# EAGLE design sputnik_prototype_RadioCom (EAGLE 7.4.0)
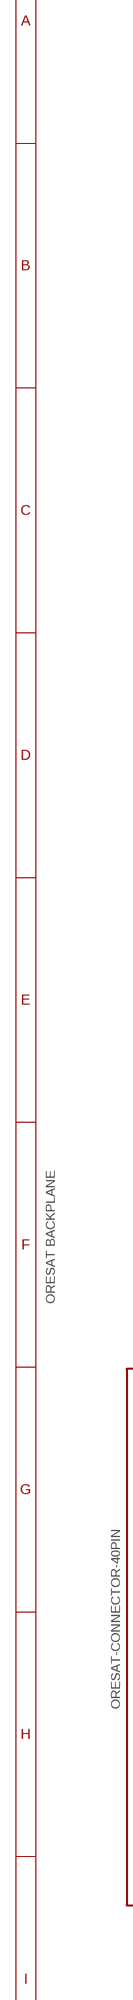
[diagram p0: schematic, sheet 1, part 1 of 2]
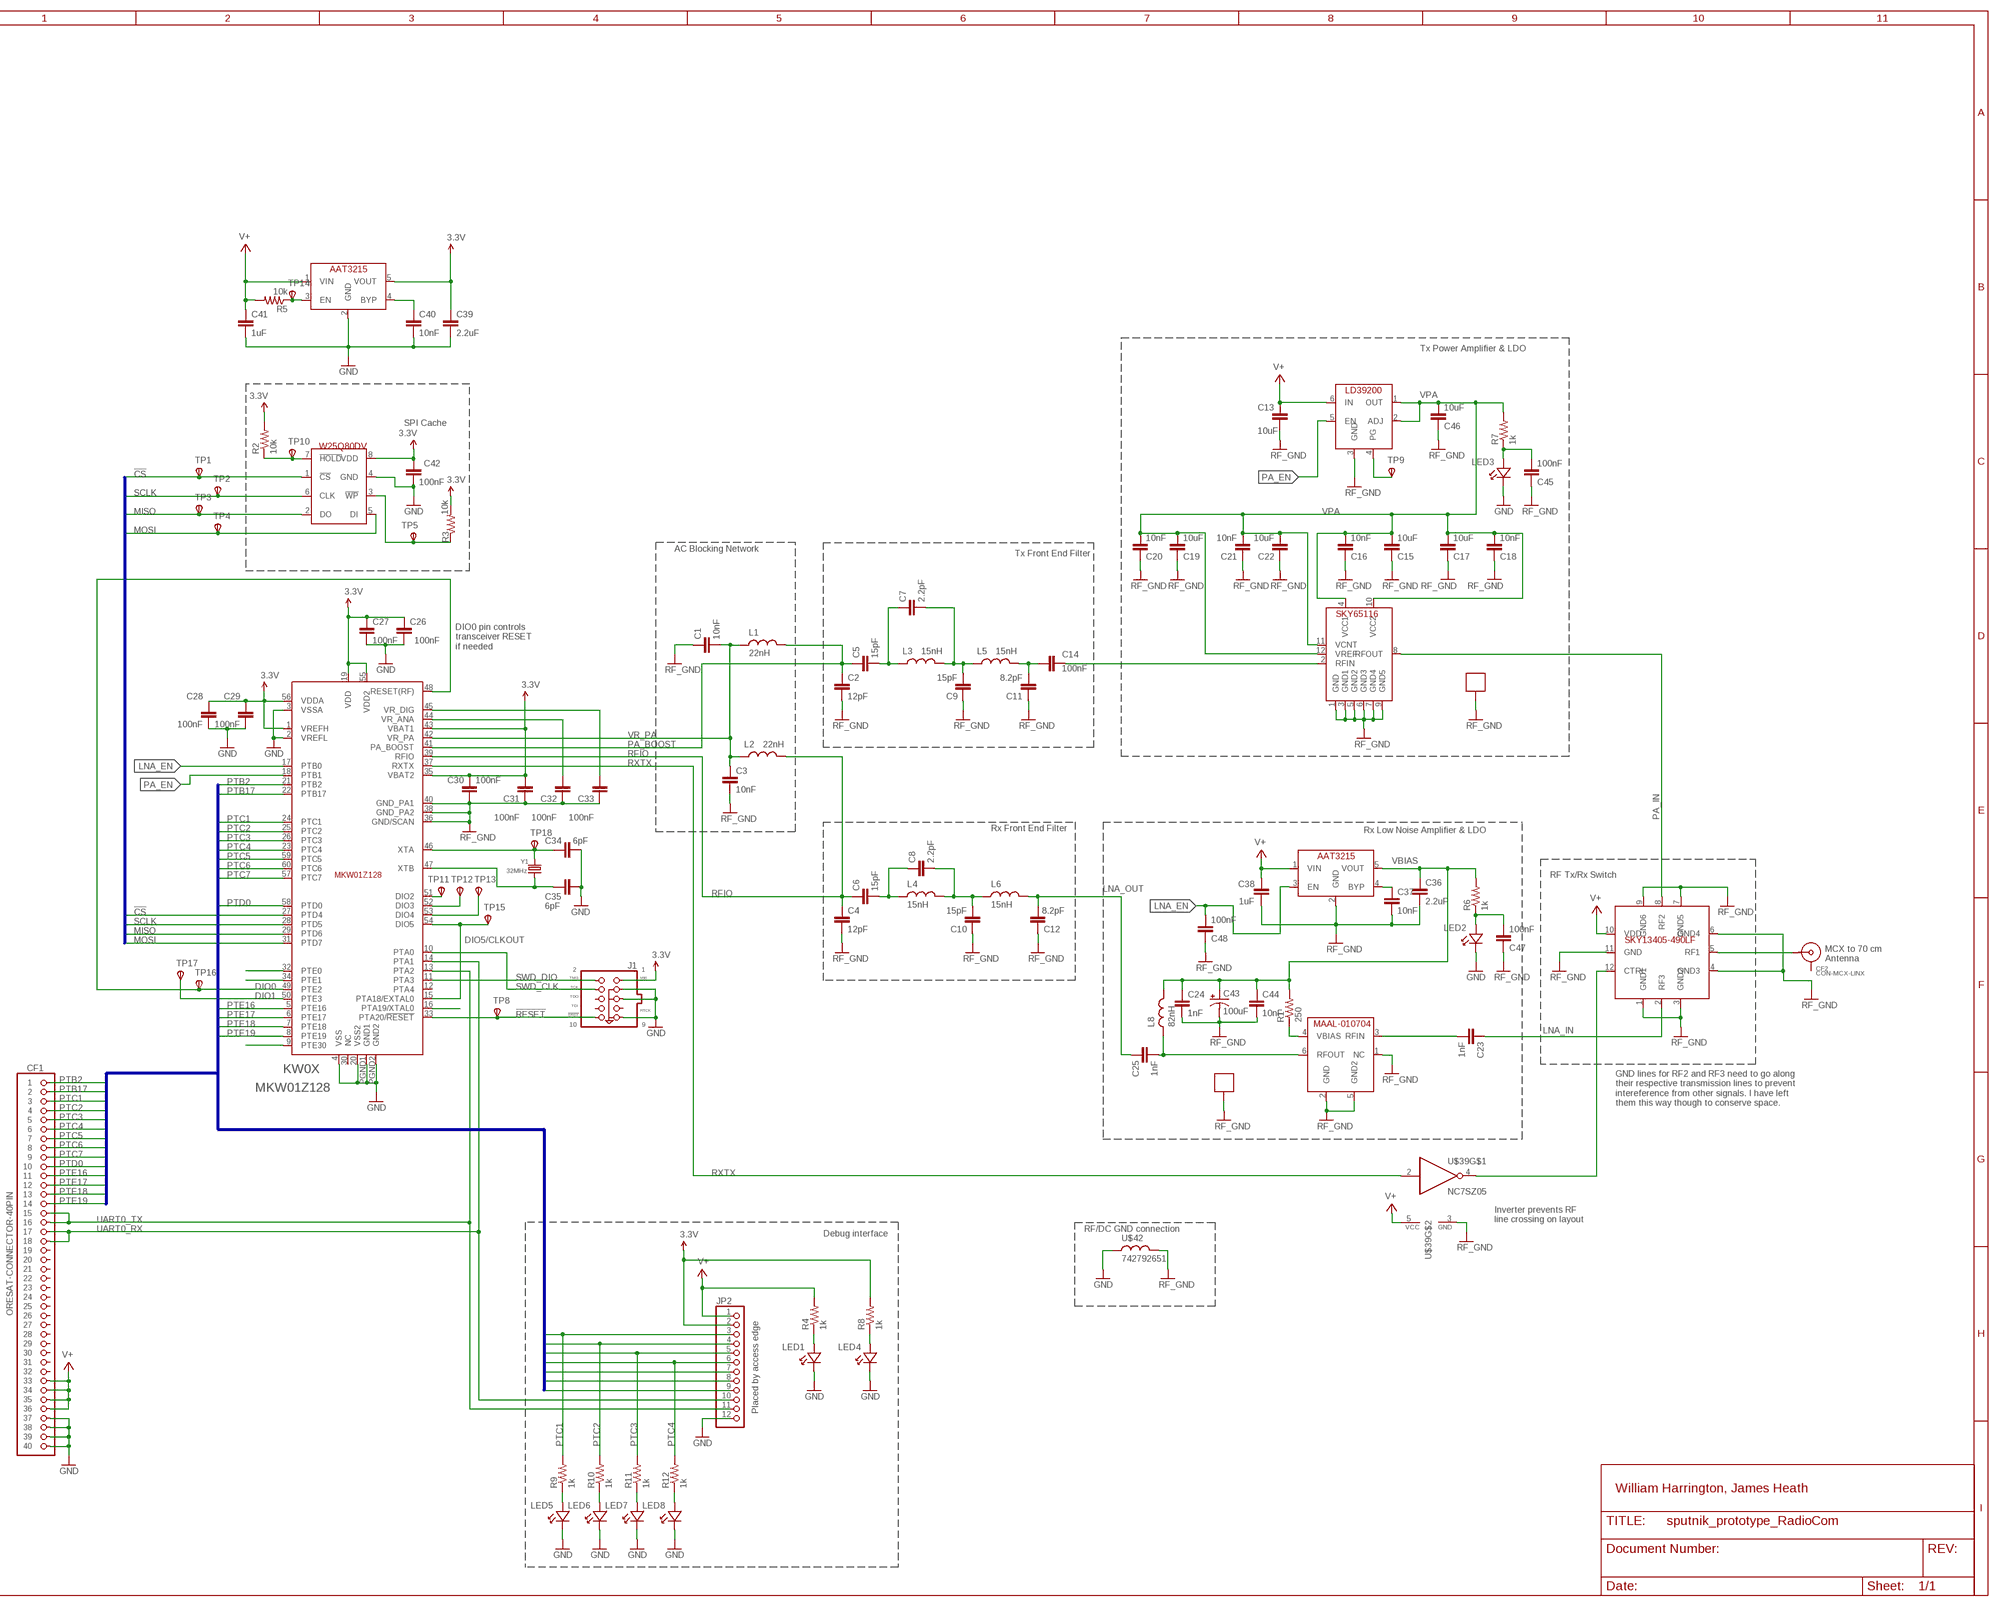
[diagram p1: schematic, sheet 1, part 2 of 2]

## Parts
C1  10nF  C-EU0603-B-NOSILK  [.0603-B-NOSILK]
C2  12pF  C-EU0603-B-NOSILK  [.0603-B-NOSILK]
C3  10nF  C-EU0603-B-NOSILK  [.0603-B-NOSILK]
C4  12pF  C-EU0603-B-NOSILK  [.0603-B-NOSILK]
C5  15pF  C-EU0603-B-NOSILK  [.0603-B-NOSILK]
C6  15pF  C-EU0603-B-NOSILK  [.0603-B-NOSILK]
C7  2.2pF  C-EU0603-B-NOSILK  [.0603-B-NOSILK]
C8  2.2pF  C-EU0603-B-NOSILK  [.0603-B-NOSILK]
C9  15pF  C-EU0603-B-NOSILK  [.0603-B-NOSILK]
C10  15pF  C-EU0603-B-NOSILK  [.0603-B-NOSILK]
C11  8.2pF  C-EU0603-B-NOSILK  [.0603-B-NOSILK]
C12  8.2pF  C-EU0603-B-NOSILK  [.0603-B-NOSILK]
C13  10uF  C-EU0603-B-NOSILK  [.0603-B-NOSILK]
C14  100nF  C-EU0603-B-NOSILK  [.0603-B-NOSILK]
C15  10uF  C-EU0603-B-NOSILK  [.0603-B-NOSILK]
C16  10nF  C-EU0603-B-NOSILK  [.0603-B-NOSILK]
C17  10uF  C-EU0603-B-NOSILK  [.0603-B-NOSILK]
C18  10nF  C-EU0603-B-NOSILK  [.0603-B-NOSILK]
C19  10uF  C-EU0603-B-NOSILK  [.0603-B-NOSILK]
C20  10nF  C-EU0603-B-NOSILK  [.0603-B-NOSILK]
C21  10nF  C-EU0603-B-NOSILK  [.0603-B-NOSILK]
C22  10uF  C-EU0603-B-NOSILK  [.0603-B-NOSILK]
C23  1nF  C-EU0402-B-NOSILK  [.0402-B-NOSILK]
C24  1nF  C-EU0402-B-NOSILK  [.0402-B-NOSILK]
C25  1nF  C-EU0402-B-NOSILK  [.0402-B-NOSILK]
C26  100nF  C-EU0603-B-NOSILK  [.0603-B-NOSILK]
C27  100nF  C-EU0603-B-NOSILK  [.0603-B-NOSILK]
C28  100nF  C-EU0603-B-NOSILK  [.0603-B-NOSILK]
C29  100nF  C-EU0603-B-NOSILK  [.0603-B-NOSILK]
C30  100nF  C-EU0603-B-NOSILK  [.0603-B-NOSILK]
C31  100nF  C-EU0603-B-NOSILK  [.0603-B-NOSILK]
C32  100nF  C-EU0603-B-NOSILK  [.0603-B-NOSILK]
C33  100nF  C-EU0603-B-NOSILK  [.0603-B-NOSILK]
C34  6pF  C-EU0603-B-NOSILK  [.0603-B-NOSILK]
C35  6pF  C-EU0603-B-NOSILK  [.0603-B-NOSILK]
C36  2.2uF  C-EU0402-B-NOSILK  [.0402-B-NOSILK]
C37  10nF  C-EU0402-B-NOSILK  [.0402-B-NOSILK]
C38  1uF  C-EU0402-B-NOSILK  [.0402-B-NOSILK]
C39  2.2uF  C-EU0402-B-NOSILK  [.0402-B-NOSILK]
C40  10nF  C-EU0402-B-NOSILK  [.0402-B-NOSILK]
C41  1uF  C-EU0402-B-NOSILK  [.0402-B-NOSILK]
C42  100nF  C-EU0603-B-NOSILK  [.0603-B-NOSILK]
C43  100uF  CPOL-USCT6032  [CT6032]
C44  10nF  C-EU0402-B-NOSILK  [.0402-B-NOSILK]
C45  100nF  C-EU0603-B-NOSILK  [.0603-B-NOSILK]
C46  10uF  C-EU0603-B-NOSILK  [.0603-B-NOSILK]
C47  100nF  C-EU0603-B-NOSILK  [.0603-B-NOSILK]
C48  100nF  C-EU0603-B-NOSILK  [.0603-B-NOSILK]
CF1  ORESAT-CONNECTOR-40PIN  [HARWIN-ARCHER-M50-3202045]
CF2  CON-MCX-LINX  [CON-MCX-LINX-CONMCX003.062]
J1  JTAG_ARM-10-50MIL  [PINHEADER-2X5-0.05+POL+SILK]
JP2  PINHD-1X12  [1X12]
KW0X  MKW01Z128  [MKW01Z128]
L1  22nH  L-US0603-B-NOSILK  [.0603-B-NOSILK]
L2  22nH  L-US0603-B-NOSILK  [.0603-B-NOSILK]
L3  15nH  L-US0603-B-NOSILK  [.0603-B-NOSILK]
L4  15nH  L-US0603-B-NOSILK  [.0603-B-NOSILK]
L5  15nH  L-US0603-B-NOSILK  [.0603-B-NOSILK]
L6  15nH  L-US0603-B-NOSILK  [.0603-B-NOSILK]
L8  82nH  L-US0603-B-NOSILK  [.0603-B-NOSILK]
LED1  LED-0603  [LED-0603]
LED2  LED-0603  [LED-0603]
LED3  LED-0603  [LED-0603]
LED4  LED-0603  [LED-0603]
LED5  LED-0603  [LED-0603]
LED6  LED-0603  [LED-0603]
LED7  LED-0603  [LED-0603]
LED8  LED-0603  [LED-0603]
LNA  MAAL-010704  [MAAL-010704]
PA  SKY65116  [SKY65116]
R1  250  R-US_0603-B-NOSILK  [.0603-B-NOSILK]
R2  10k  R-US_0603-B-NOSILK  [.0603-B-NOSILK]
R3  10k  R-US_0603-B-NOSILK  [.0603-B-NOSILK]
R4  1k  R-US_0603-B-NOSILK  [.0603-B-NOSILK]
R5  10k  R-US_0603-B-NOSILK  [.0603-B-NOSILK]
R6  1k  R-US_0603-B-NOSILK  [.0603-B-NOSILK]
R7  1k  R-US_0603-B-NOSILK  [.0603-B-NOSILK]
R8  1k  R-US_0603-B-NOSILK  [.0603-B-NOSILK]
R9  1k  R-US_0603-B-NOSILK  [.0603-B-NOSILK]
R10  1k  R-US_0603-B-NOSILK  [.0603-B-NOSILK]
R11  1k  R-US_0603-B-NOSILK  [.0603-B-NOSILK]
R12  1k  R-US_0603-B-NOSILK  [.0603-B-NOSILK]
SH1  BMI-S-202-SHIELD  [BMI-S-202]
SH2  BMI-S-202-SHIELD  [BMI-S-202]
TP1  TPSPAD1-13  [P1-13]
TP2  TPSPAD1-13  [P1-13]
TP3  TPSPAD1-13  [P1-13]
TP4  TPSPAD1-13  [P1-13]
TP5  TPSPAD1-13  [P1-13]
TP8  TPSPAD1-13  [P1-13]
TP9  TPSPAD1-13  [P1-13]
TP10  TPSPAD1-13  [P1-13]
TP11  TPSPAD1-13  [P1-13]
TP12  TPSPAD1-13  [P1-13]
TP13  TPSPAD1-13  [P1-13]
TP14  TPSPAD1-13  [P1-13]
TP15  TPSPAD1-13  [P1-13]
TP16  TPSPAD1-13  [P1-13]
TP17  TPSPAD1-13  [P1-13]
TP18  TPSPAD1-13  [P1-13]
TRSWITCH  SKY13405-490LF  [SKY13405-490LF]
U$1  W25Q80DV  [W25Q80DV]
U$7  AAT3215  [AAT3215]
U$8  AAT3215  [AAT3215]
U$9  LD39200  [LD39200]
U$39  NC7SZ05  [NC7SZ05]
U$42  742792651  [.0603-B-NOSILK]
Y1  32MHz  CRYSTAL2.5X2.0MM  [CRYSTAL_2.5X2]

## Nets
3.3V: C26.1 C27.1 C28.2 C29.2 C30.2 C31.2 C39.1 C42.2 J1.1(VDD) JP2.2 KW0X.1(VREFH) KW0X.19(VDD) KW0X.35(VBAT2) KW0X.43(VBAT1) KW0X.55(VDD2) KW0X.56(VDDA) R2.2 R3.2 R8.2 U$1.8(VDD) U$8.5(VOUT)
!CS: KW0X.27(PTD4) TP1.TP(PP) U$1.1(!CS)
!HOLD: R2.1 TP10.TP(PP) U$1.7(!HOLD)
!RESET: J1.10(SRST) KW0X.33(PTA20/!RESET) TP8.TP(PP)
ASD: C47.1 ; supply symbol labelled RF_GND
DIO0: KW0X.48(RESET(RF)) KW0X.49(PTE2) TP16.TP(PP)
DIO1: KW0X.50(PTE3) TP17.TP(PP)
DIO5/CLKOUT: KW0X.15(PTA18/EXTAL0) KW0X.54(DIO5) TP15.TP(PP)
GND: C26.2 C27.2 C28.1 C29.1 C34.1 C35.1 C36.2 C37.2 C38.2 C39.2 C40.2 C41.2 C42.1 C48.1 CF1.P$37 CF1.P$38 CF1.P$39 CF1.P$40 J1.3(GND3) J1.5(GND5) J1.9(GND9) JP2.12 KW0X.2(VREFL) KW0X.3(VSSA) KW0X.4(VSS) KW0X.20(VSS2) KW0X.PGND1(GND1) KW0X.PGND2(GND2) LED1.K LED2.K LED3.K LED4.K LED5.K LED6.K LED7.K LED8.K LNA.1(NC) TRSWITCH.11(GND) U$1.4(GND) U$7.2(GND) U$8.2(GND) U$42.1 ; supply symbol labelled RF_GND
LNA_EN: C48.2 KW0X.17(PTB0) U$7.3(EN)
LNA_IN: C23.1 TRSWITCH.2(RF3)
LNA_OUT: C12.2 C25.1 L6.2
MISO: KW0X.29(PTD6) TP3.TP(PP) U$1.2(DO)
MOSI: KW0X.31(PTD7) TP4.TP(PP) U$1.5(DI)
N$1: C37.1 U$7.4(BYP)
N$2: TRSWITCH.12(CTRL) U$39.4(OUT)
N$3: KW0X.51(DIO2) TP11.TP(PP)
N$4: TP9.TP(PP) U$9.4(PG)
N$5: KW0X.52(DIO3) TP12.TP(PP)
N$6: C34.2 KW0X.46(XTA) TP18.TP(PP) Y1.1
N$7: C25.2 L8.1 LNA.6(RFOUT)
N$8: C35.2 KW0X.47(XTB) Y1.3
N$9: KW0X.53(DIO4) TP13.TP(PP)
N$10: C5.2 C7.1 L3.1
N$11: R3.1 TP5.TP(PP) U$1.3(!WP)
N$12: R5.1 TP14.TP(PP) U$8.3(EN)
N$13: C40.1 U$8.4(BYP)
N$14: LED1.A R4.1
N$15: LED5.A R9.1
N$16: C7.2 C9.2 L3.2 L5.1
N$17: C11.2 C14.2 L5.2
N$18: C6.2 C8.1 L4.1
N$19: C8.2 C10.2 L4.2 L6.1
N$20: LED6.A R10.1
N$21: LED7.A R11.1
N$22: LED4.A R8.1
N$23: LED8.A R12.1
N$25: C23.2 LNA.3(RFIN)
N$27: LNA.4(VBIAS) R1.1
N$30: CF2.CENTER TRSWITCH.5(RF1)
N$31: C32.2 KW0X.44(VR_ANA)
N$34: C33.2 KW0X.45(VR_DIG)
N$43: C14.1 PA.2(RFIN)
PA_BOOST: C2.1 C5.1 KW0X.41(PA_BOOST) L1.2
PA_EN: KW0X.18(PTB1) U$9.5(EN)
PA_IN: PA.8(RFOUT) TRSWITCH.8(RF2)
PTA19: KW0X.16(PTA19/XTAL0)
PTB2: CF1.P$1 KW0X.21(PTB2)
PTB17: CF1.P$2 KW0X.22(PTB17)
PTC1: CF1.P$3 JP2.3 KW0X.24(PTC1) R9.2
PTC2: CF1.P$4 JP2.4 KW0X.25(PTC2) R10.2
PTC3: CF1.P$5 JP2.5 KW0X.26(PTC3) R11.2
PTC4: CF1.P$6 JP2.6 KW0X.23(PTC4) R12.2
PTC5: CF1.P$7 JP2.7 KW0X.59(PTC5)
PTC6: CF1.P$8 JP2.8 KW0X.60(PTC6)
PTC7: CF1.P$9 JP2.9 KW0X.57(PTC7)
PTD0: CF1.P$10 KW0X.58(PTD0)
PTE0: KW0X.32(PTE0)
PTE1: KW0X.34(PTE1)
PTE16: CF1.P$11 KW0X.5(PTE16)
PTE17: CF1.P$12 KW0X.6(PTE17)
PTE18: CF1.P$13 KW0X.7(PTE18)
PTE19: CF1.P$14 KW0X.8(PTE19)
PTE30: KW0X.9(PTE30)
RF_GND: C1.1 C2.2 C3.2 C4.2 C9.1 C10.1 C11.1 C12.1 C13.1 C15.1 C16.1 C17.1 C18.1 C19.1 C20.1 C21.1 C22.1 C24.2 C30.1 C31.1 C32.1 C33.1 C43.- C44.2 C45.1 C46.1 KW0X.36(GND/SCAN) KW0X.38(GND_PA2) KW0X.40(GND_PA1) LNA.2(GND) LNA.5(GND2) PA.1(GND) PA.3(GND1) PA.5(GND2) PA.6(GND3) PA.7(GND4) PA.9(GND5) SH1.P$1 SH1.P$2 SH1.P$3 SH1.P$4 SH1.P$5 SH1.P$6 SH1.P$7 SH1.P$8 SH1.P$9 SH1.P$10 SH1.P$11 SH1.P$12 SH2.P$1 SH2.P$2 SH2.P$3 SH2.P$4 SH2.P$5 SH2.P$6 SH2.P$7 SH2.P$8 SH2.P$9 SH2.P$10 SH2.P$11 SH2.P$12 TRSWITCH.1(GND1) TRSWITCH.3(GND2) TRSWITCH.4(GND3) TRSWITCH.6(GND4) TRSWITCH.7(GND5) TRSWITCH.9(GND6) U$9.3(GND) U$39.3(GND) U$42.2
RFIO: C4.1 C6.1 KW0X.39(RFIO) L2.2
RXTX: KW0X.37(RXTX) U$39.2(IN)
SCLK: KW0X.28(PTD5) TP2.TP(PP) U$1.6(CLK)
SWD_CLK: J1.4(TCK) KW0X.10(PTA0)
SWD_DIO: J1.2(TMS) KW0X.11(PTA3)
UART0_RX: CF1.P$17 CF1.P$18 JP2.10 KW0X.14(PTA1)
UART0_TX: CF1.P$15 CF1.P$16 JP2.11 KW0X.13(PTA2)
V+: C13.2 C38.1 C41.1 CF1.P$33 CF1.P$34 CF1.P$35 CF1.P$36 JP2.1 R4.2 R5.2 TRSWITCH.10(VDD) U$7.1(VIN) U$8.1(VIN) U$9.6(IN) U$39.5(VCC)
V_LNA_FILTERED: C47.2 LED2.A R6.1
V_PA_FILTERED: C45.2 LED3.A R7.1
VBIAS: C24.1 C36.1 C43.+ C44.1 L8.2 R1.2 R6.2 U$7.5(VOUT)
VPA: C15.2 C16.2 C17.2 C18.2 C19.2 C20.2 C21.2 C22.2 C46.2 PA.4(VCC1) PA.10(VCC2) PA.11(VCNT) PA.12(VREF) R7.2 U$9.1(OUT) U$9.2(ADJ)
VR_PA: C1.2 C3.1 KW0X.42(VR_PA) L1.1 L2.1
Unconnected: CF1.P$19 CF1.P$20 CF1.P$21 CF1.P$22 CF1.P$23 CF1.P$24 CF1.P$25 CF1.P$26 CF1.P$27 CF1.P$28 CF1.P$29 CF1.P$30 CF1.P$31 CF1.P$32 CF2.SHIELD1(SHIELD) CF2.SHIELD2(SHIELD) CF2.SHIELD3(SHIELD) CF2.SHIELD4(SHIELD) J1.6(TDO) J1.7(RTCK) J1.8(TDI) KW0X.12(PTA4) KW0X.30(NC)

## Buses
PTB2,PTB17,PTC[1..7],PTD0,PTE[16..19],PTE30
!HOLD,!CS,SCLK,MISO,MOSI,!WP

## Notes on the sheet
- Tx Power Amplifier & LDO
- SPI Cache
- AC Blocking Network
- Tx Front End Filter
- DIO0 pin controls 
  transceiver RESET
  if needed
- Rx Low Noise Amplifier & LDO
- Rx Front End Filter
- RF Tx/Rx Switch
- MCX to 70 cm
  Antenna
- ORESAT BACKPLANE
- GND lines for RF2 and RF3 need to go along
  their respective transmission lines to prevent
  intereference from other signals. I have left
  them this way though to conserve space.
- Inverter prevents RF 
  line crossing on layout
- RF/DC GND connection
- Debug interface
- Placed by access edge
- William Harrington, James Heath

## Library data of the parts
C1-C42 C44-C48 = rcl_custom:C-EU: CAPACITOR, European symbol
C43 = rcl:CPOL-US: POLARIZED CAPACITOR, American symbol
CF1 = oresat-eagle:ORESAT-CONNECTOR-40PIN: OreSat 40pin card connector. Uses the Harwin Archer M50-3202045.
CF2 = oresat-eagle:CON-MCX-LINX: Linx Technologies MCX Connector #CONMCX003.062
J1 = psas_c3_team05:JTAG_ARM-10-*: JTAG PIN HEADER 2x5 This is one of the (smaller) ARM standard JTAG connectors.
JP2 = pinhead:PINHD-1X12: PIN HEADER
KW0X = psas_c3_team05:MKW01Z128; DIST: Digi-Key; DPN: MKW01Z128CHN-ND; MFN: NXP; MPN: MKW01Z128CHN
L1-L6 L8 = rcl_custom:L-US: INDUCTOR, American symbol
LED1-LED8 = psas_c3_team05:LED: Generic LED with Color designator as an attribute.
LNA = sputnik:MAAL-010704: MACOM MAAL-010704 Low Noise Amplifier; DIST: Digi-Key; DPN: 1465-1261-6-ND; MFN: M/A-Com Technology Solutions; MPN: MAAL-010704-TR3000
PA = psas_c3_team05:SKY65116: SKYWORK SKY65116 LINEAR POWER AMPLIFIER; MFN: Skyworks; MPN: SKY65116
R1-R12 = rcl_custom:R-US_: RESISTOR, American symbol
SH1 SH2 = hw-laird-bmi-s-202:BMI-S-202-SHIELD
TP1-TP5 TP8-TP18 = testpad:TPS: TEST PIN
TRSWITCH = psas_c3_team05:SKY13405-490LF; MFN: Skyworks; MPN: SKY13405-490LF
U$1 = psas_c3_team05:W25Q80DV
U$7 U$8 = psas_c3_team05:AAT3215; MFN: Skyworks; MFN-PN: AAT3215
U$9 = psas_c3_team05:LD39200
U$39 = psas_c3_team05:NC7SZ05: Single Inverter
U$42 = psas_c3_team05:742792651: Ferrite Bead
Y1 = microbuilder:CRYSTAL: Crystals HC49UP - Surface Mount Crystal 4.0MHz 18pF +/-30ppm Surface Mount Crystal [Digikey: 535-9857-1-ND] 12.0 MHz Surface Mount Crystal [Digikey: 535-9869-6-ND] 25.0 MHz Surface Mount Crystal [Digikey: 535-9078-1-ND] 2.5 x 2.0mm - MEMs SMT Crystal 16.0 MHz 10pF 20ppm 2.5 x 2.0mm Crystal [Digikey -40-85°C: 535-10923-1-ND] 3.2 x 2.5mm - MEMs SMT Crystal 12.0 MHz 8pF 15ppm 3.2 x 2.5mm Crystal [Digikey: -10-70°C: 644-1047-1-ND -40-125°C: 644-1128-1-ND] 16.0 MHz 8pF 15ppm 3.2 x 2.5mm Crystal [Digikey: -10-70°C: 644-1049-1-ND -40-125°C: 644-1129-2-ND] 16.0 MHz 10pF 10ppm 3.2 x 2.5mm Crystal [Digikey: 644-1100-1-ND] 27.12 MHz 18pF 30ppm 3.2 x 2.5mm Crystal [Digikey: 887-1424-1-ND] 27.12MHz 10pF 10ppm 3.2 x 2.5mm Crystal [Digikey: 887-1329-1-ND] 4.9 x 1.8mm - MEMs SMT Crystal 32.768 KHz 12.5pF 20ppm 4.9 x 1.8mm Crystal [Digikey: SE2415CT-ND] 8.0 x 3.8mm - Surface Mount Crystal 32.768kHz 12.5pF 20ppm -40°C-85°C [Digikey: 535-9166-2-ND] Cylinder 32.768KHz Cylinder Crystal (2x6mm body) [Ex. Digikey: 300-8341-2-ND]; DIST: Digi-Key; DPN: SER4044CT-ND; MFN: EPSON; MPN: FA20H 32.0000MF12Y-W3

## Board
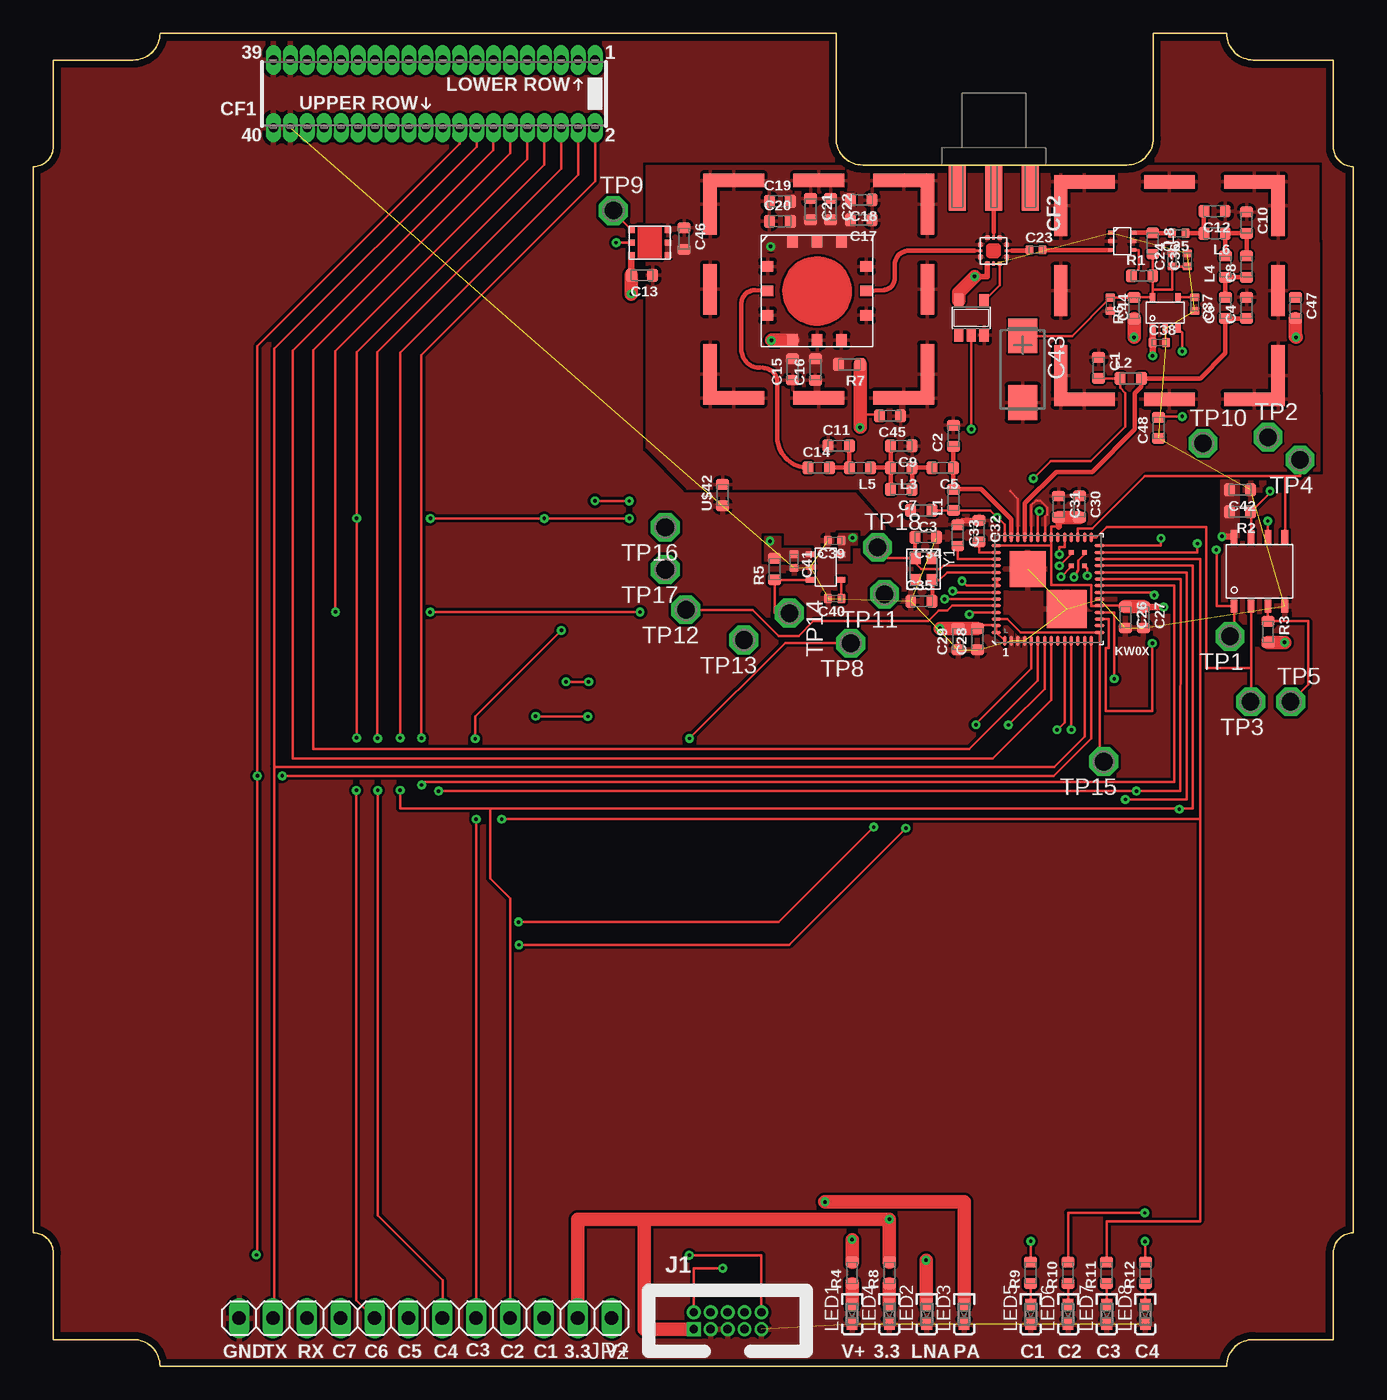
[diagram p2: board, top side]
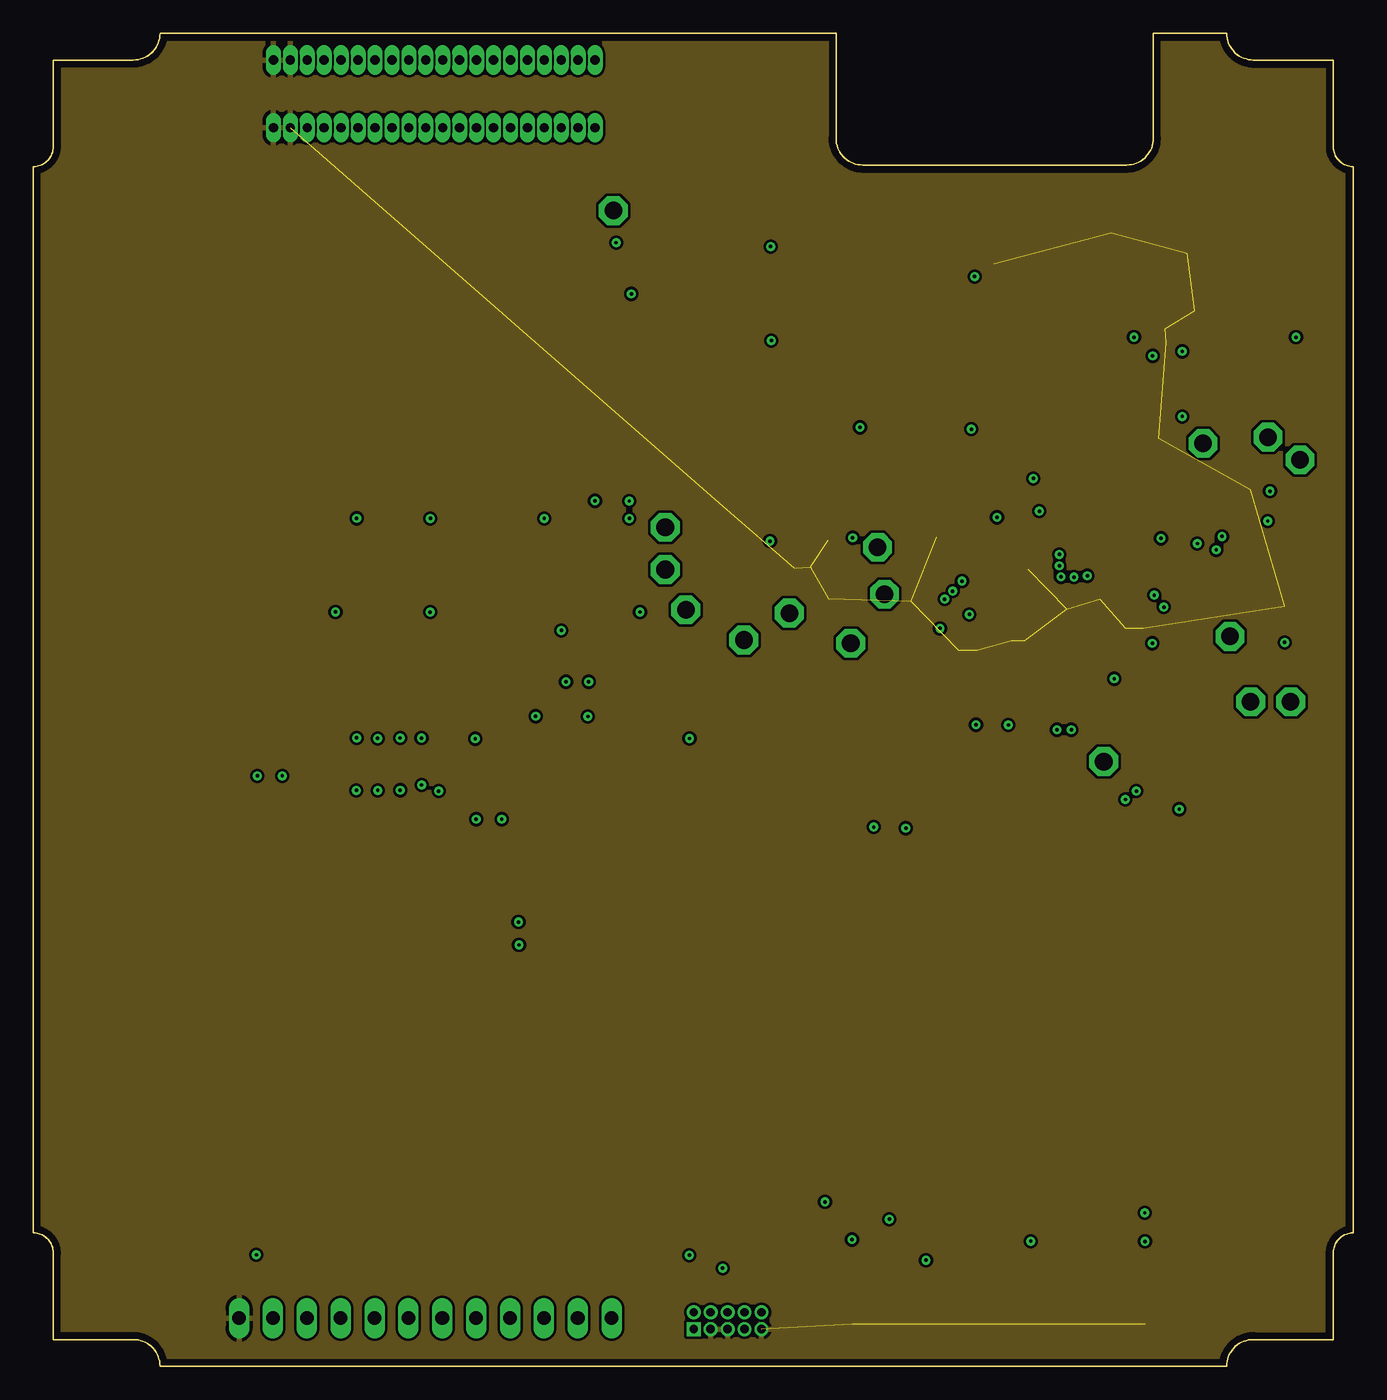
[diagram p3: board, inner layer Route2]
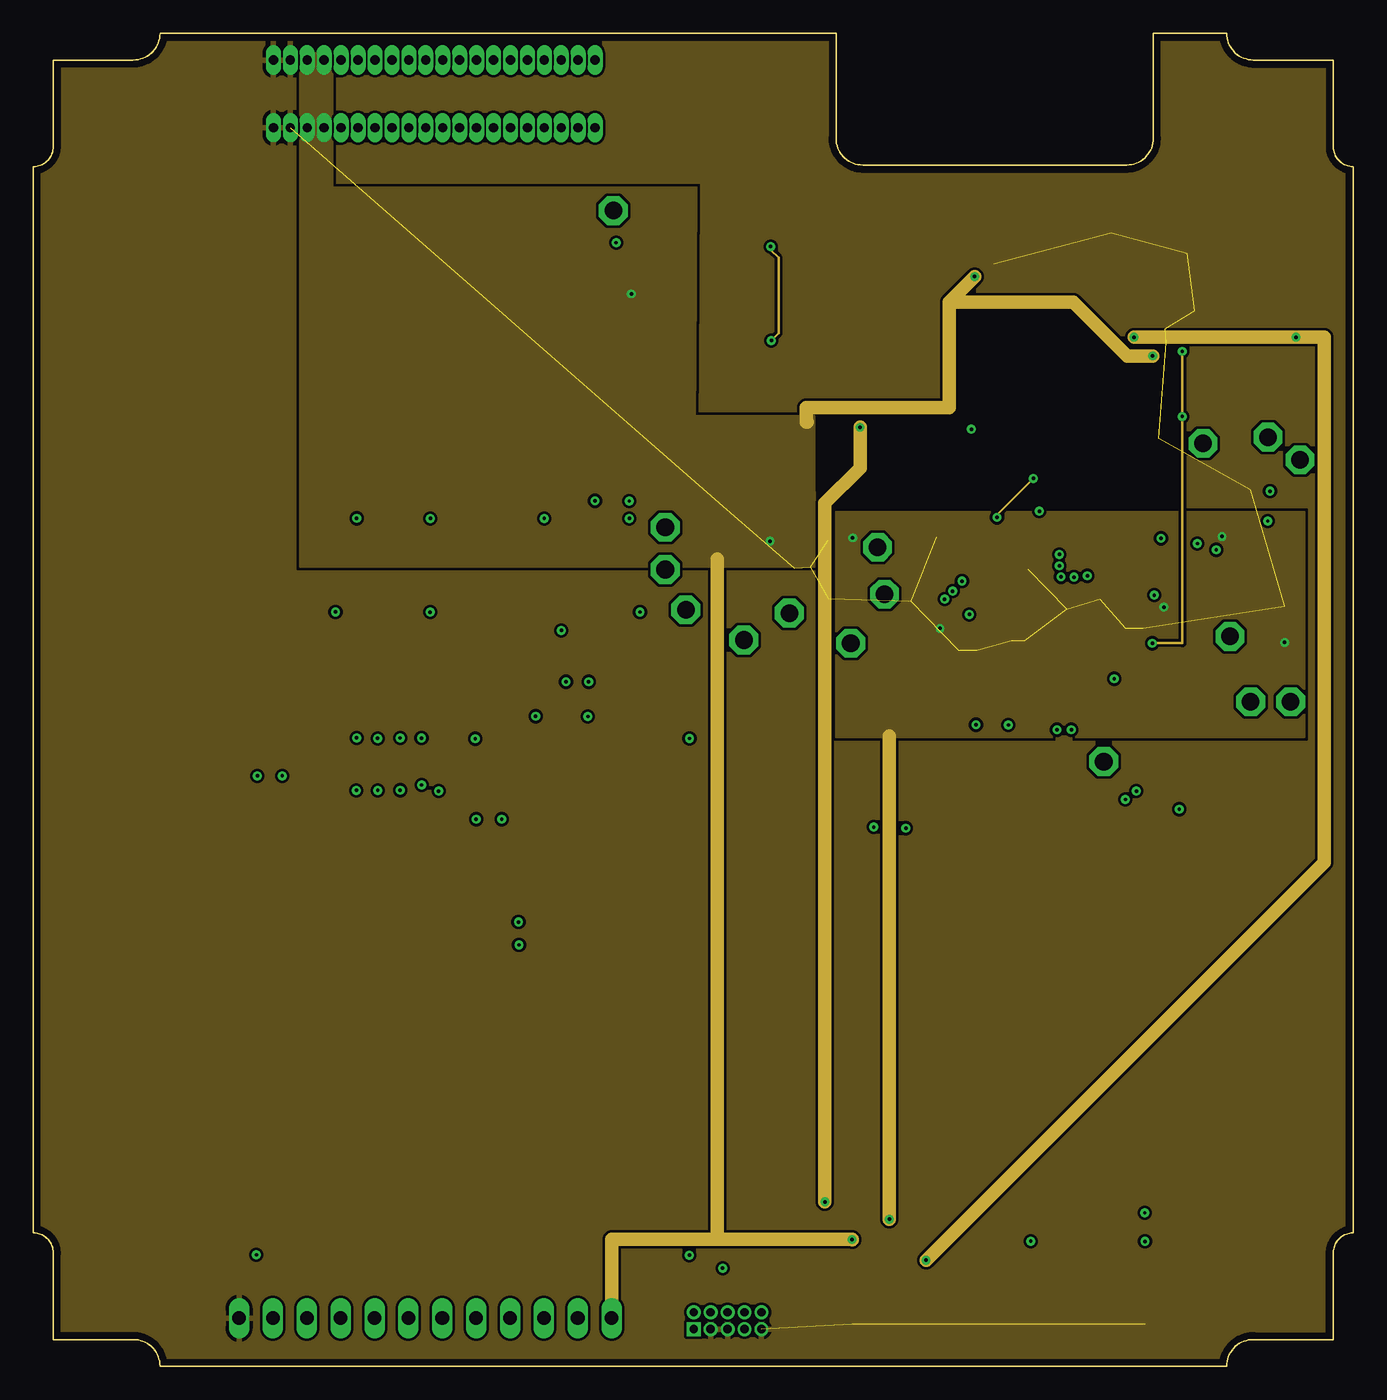
[diagram p4: board, inner layer Route15]
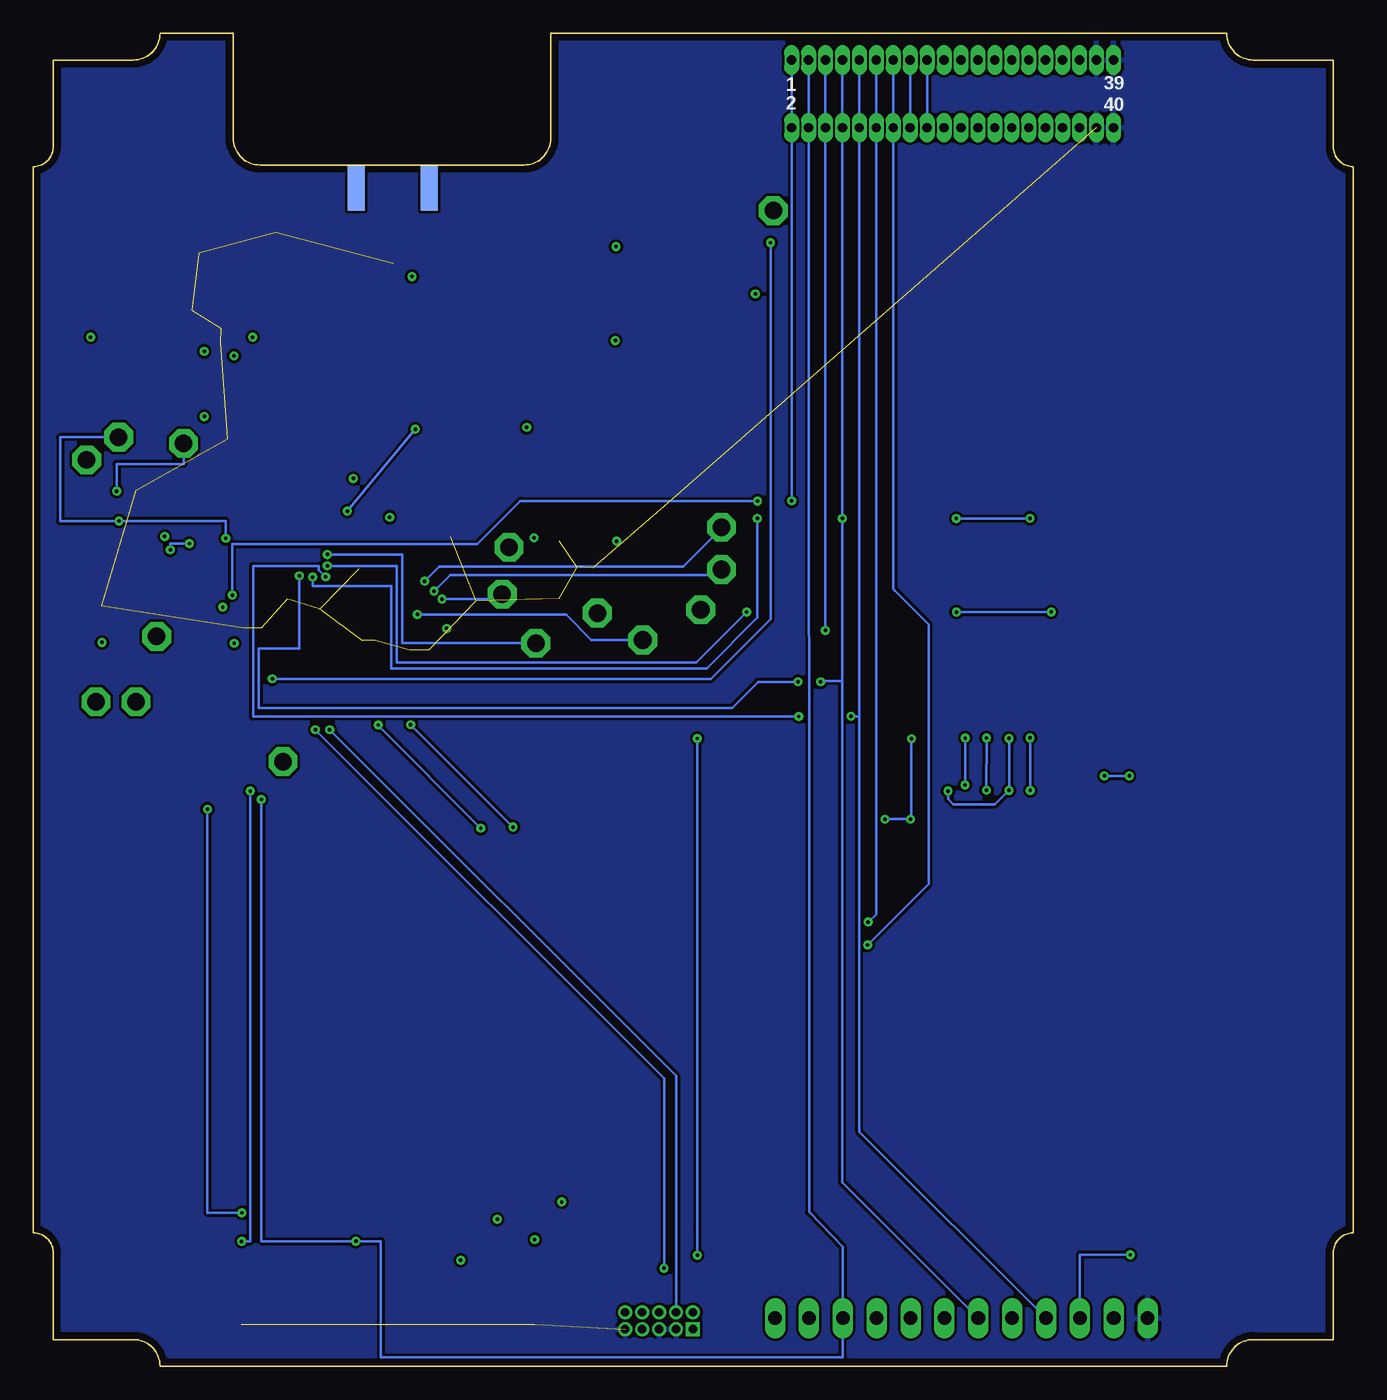
[diagram p5: board, bottom side, seen from below]

Size 99 x 100 mm. Coordinates in mm from the lower left corner, seen from the top.
Copper layers (1+2*15+16): Top 0.0178mm / dielectric 12mil / Route2 0.0356mm / dielectric 28mil / Route15 0.0356mm / dielectric 12mil / Bottom 0.0178mm
Design rules "sunstone-4Lyr_v1.0.0.3 *": minimum track width 6mil, minimum drill 10mil, track to track 6mil, track to pad 6mil, pad to pad 6mil, via to via 6mil, smd to smd 6mil, copper to edge 20mil, drill to drill 16mil, minimum pad ring 8mil, minimum via ring 8mil, stop-mask expansion 3mil, vias tented up to drill 11mil, thermal gap 10mil

### Footprints (pad centres in the part's own frame; a part is rotated, then mirrored left to right if it is on the bottom)
.0603-B-NOSILK = smd 0.8 x 0.95: 1 -0.8,0; 2 0.8,0
.0402-B-NOSILK = smd 0.6 x 0.7: 1 -0.5,0; 2 0.5,0
CT6032 = smd 2.6 x 2.2: + -2.5,0; - 2.5,0
HARWIN-ARCHER-M50-3202045 = drill 0.7 pad 1.07 long: P$1 -12.065,-2.54; P$2 -12.065,2.54; P$3 -10.795,-2.54; P$4 -10.795,2.54; P$5 -9.525,-2.54; P$6 -9.525,2.54; P$7 -8.255,-2.54; P$8 -8.255,2.54; P$9 -6.985,-2.54; P$10 -6.985,2.54; P$11 -5.715,-2.54; P$12 -5.715,2.54; P$13 -4.445,-2.54; P$14 -4.445,2.54; P$15 -3.175,-2.54; P$16 -3.175,2.54; P$17 -1.905,-2.54; P$18 -1.905,2.54; P$19 -0.635,-2.54; P$20 -0.635,2.54; P$21 0.635,-2.54; P$22 0.635,2.54; P$23 1.905,-2.54; P$24 1.905,2.54; P$25 3.175,-2.54; P$26 3.175,2.54; P$27 4.445,-2.54; P$28 4.445,2.54; P$29 5.715,-2.54; P$30 5.715,2.54; P$31 6.985,-2.54; P$32 6.985,2.54; P$33 8.255,-2.54; P$34 8.255,2.54; P$35 9.525,-2.54; P$36 9.525,2.54; P$37 10.795,-2.54; P$38 10.795,2.54; P$39 12.065,-2.54; P$40 12.065,2.54
CON-MCX-LINX-CONMCX003.062 = smd 3.43 x 1.27: CENTER -1.715,0; SHIELD1 -1.715,2.74; SHIELD2 -1.715,-2.74 | smd 3.43 x 1.27 bottom: SHIELD3 -1.715,2.74; SHIELD4 -1.715,-2.74
PINHEADER-2X5-0.05+POL+SILK = drill 0.635 pad 1.04 square: 1 -2.54,-0.635 | drill 0.635 pad 1.04: 2 -2.54,0.635; 3 -1.27,-0.635; 4 -1.27,0.635; 5 0,-0.635; 6 0,0.635; 7 1.27,-0.635; 8 1.27,0.635; 9 2.54,-0.635; 10 2.54,0.635
1X12 = drill 1.016 long: 1 -13.97,0; 2 -11.43,0; 3 -8.89,0; 4 -6.35,0; 5 -3.81,0; 6 -1.27,0; 7 1.27,0; 8 3.81,0; 9 6.35,0; 10 8.89,0; 11 11.43,0; 12 13.97,0
MKW01Z128 = smd 0.25 x 0.71: 1 -3.25,-3.878; 2 -2.75,-3.878; 3 -2.25,-3.878; 4 -1.75,-3.878; 5 -1.25,-3.878; 6 -0.75,-3.878; 7 -0.25,-3.878; 8 0.25,-3.878; 9 0.75,-3.878; 10 1.25,-3.878; 11 1.75,-3.878; 12 2.25,-3.878; 13 2.75,-3.878; 14 3.25,-3.878; 29 3.25,3.878; 30 2.75,3.878; 31 2.25,3.878; 32 1.75,3.878; 33 1.25,3.878; 34 0.75,3.878; 35 0.25,3.878; 36 -0.25,3.878; 37 -0.75,3.878; 38 -1.25,3.878; 39 -1.75,3.878; 40 -2.25,3.878; 41 -2.75,3.878; 42 -3.25,3.878 | smd 0.71 x 0.25: 15 3.878,-3.25; 16 3.878,-2.75; 17 3.878,-2.25; 18 3.878,-1.75; 19 3.878,-1.25; 20 3.878,-0.75; 21 3.878,-0.25; 22 3.878,0.25; 23 3.878,0.75; 24 3.878,1.25; 25 3.878,1.75; 26 3.878,2.25; 27 3.878,2.75; 28 3.878,3.25; 43 -3.878,3.25; 44 -3.878,2.75; 45 -3.878,2.25; 46 -3.878,1.75; 47 -3.878,1.25; 48 -3.878,0.75; 49 -3.878,0.25; 50 -3.878,-0.25; 51 -3.878,-0.75; 52 -3.878,-1.25; 53 -3.878,-1.75; 54 -3.878,-2.25; 55 -3.878,-2.75; 56 -3.878,-3.25 | smd 0.35 x 0.35: 57 1.75,1.75; 58 1.75,2.75; 59 2.75,1.75; 60 2.75,2.75 | smd 2.72 x 2.72: PGND1 -1.5,1.5 | smd 3 x 2.87: PGND2 1.42,-1.5
LED-0603 = smd 0.8 x 0.8: A 0.75,0; K -0.75,0
MAAL-010704 = smd 0.3 x 0.425: 1 -0.65,-0.873; 2 0,-0.873; 3 0.65,-0.873; 4 0.65,0.802; 5 0,0.802; 6 -0.65,0.81
SKY65116 = smd 0.893 x 0.81: 1 -3.835,1.708; 2 -3.835,-0.129; 3 -3.835,-1.964; 7 3.581,-1.964; 8 3.581,-0.129; 9 3.581,1.708 | smd 0.81 x 0.893: 4 -1.962,-3.836; 5 -0.126,-3.836; 6 1.71,-3.836; 10 1.71,3.579; 11 -0.126,3.579; 12 -1.962,3.579
BMI-S-202 = smd 1 x 4.55: P$1 -8.15,-6.375; P$7 -8.15,6.375; P$11 8.15,6.375; P$12 8.15,-6.375 | smd 4.55 x 1: P$2 -6.375,-8.15; P$8 6.375,-8.15; P$9 -6.375,8.15; P$10 6.375,8.15 | smd 1 x 3.8: P$3 -8.15,0; P$6 8.15,0 | smd 3.8 x 1: P$4 0,-8.15; P$5 0,8.15
P1-13 = drill 1.321 pad 2.159 octagon: TP 0,0
SKY13405-490LF = smd 0.3 x 0.31: 1 -0.996,0.471; 3 -0.996,-0.439; 7 0.964,-0.439; 9 0.964,0.471 | smd 0.3 x 0.2: 2 -0.996,0.016; 8 0.964,0.016 | smd 0.31 x 0.3: 4 -0.471,-0.964; 6 0.439,-0.964; 10 0.439,0.996; 12 -0.471,0.996 | smd 0.2 x 0.3: 5 -0.016,-0.964; 11 -0.016,0.996
W25Q80DV = smd 0.51 x 1: 1 -1.945,-2.568; 2 -0.675,-2.568; 3 0.595,-2.568; 4 1.865,-2.568; 5 1.865,2.632; 6 0.595,2.632; 7 -0.675,2.632; 8 -1.945,2.632
AAT3215 = smd 0.4 x 0.625: 1 0.851,1.142; 2 -0.099,1.142; 3 -1.049,1.142; 4 -1.049,-1.188; 5 0.851,-1.188
LD39200 = smd 0.45 x 0.5: 1 -0.97,-1.388; 2 -0.02,-1.388; 3 0.93,-1.388; 4 0.93,1.339; 5 -0.02,1.339; 6 -0.97,1.339
NC7SZ05 = smd 0.69 x 0.99: 1 -0.95,-1.29; 2 0,-1.29; 3 0.95,-1.29; 4 0.95,1.3; 5 -0.95,1.3
CRYSTAL_2.5X2 = smd 0.9 x 0.8: 1 -0.825,-0.625; 2 0.825,-0.625; 3 0.825,0.625; 4 -0.825,0.625

### Placement (x,y rotation side)
C1  79.9,74.9 270 top
C2  69,69.8 90 top
C3  66.6,64.2 180 top
C4  91,79.4 90 top
C5  68.2,67.4 180 top
C6  89.4,79.4 90 top
C7  65.1,65.8 180 top
C8  91,82.5 90 top
C9  65.1,69.05 180 top
C10  90.99,85.79 270 top
C11  60.4,69.05 0 top
C12  88.59,86.66 180 top
C13  45.65,81.85 180 top
C14  58.9,67.4 0 top
C15  56.95,74.78 90 top
C16  58.65,74.77 90 top
C17  62.1,86 180 top
C18  62.1,87.5 180 top
C19  56,87.4 0 top
C20  56,85.9 0 top
C21  58.3,86.8 270 top
C22  59.8,86.8 270 top
C23  75.2,83.75 0 top
C24  85.41,83.01 90 top
C25  85.9,85 180 top
C26  81.91,56.18 270 top
C27  83.26,56.18 270 top
C28  70.8,54.55 90 top
C29  69.35,54.55 90 top
C30  78.45,64.5 270 top
C31  76.9,64.48 270 top
C32  70.93,62.65 270 top
C33  69.33,62.33 270 top
C34  66.93,62.2 180 top
C35  66.61,57.4 0 top
C36  86.56,83 90 top
C37  87.1,79.68 270 top
C38  84.45,76.8 0 top
C39  60.09,61.93 180 top
C40  60.1,57.6 180 top
C41  57.05,60.4 270 top
C42  90.5,65.75 180 top
C43  74.2,74.8 270 top
C44  80.77,79.67 270 top
C45  64.25,71.3 180 top
C46  48.8,84.6 270 top
C47  94.65,79.4 270 top
C48  84.4,70.4 90 top
CF1  30.07,95.46 180 top
CF2  72.04,90.12 90 top
J1  52.07,3.41 0 top
JP2  29.4,3.6 180 top
KW0X  76.09,58.31 0 top
L1  69,65 90 top
L2  82.3,74.1 0 top
L3  65.1,67.4 180 top
L4  89.4,82.5 90 top
L5  62,67.4 180 top
L6  88.59,85 180 top
L8  83.96,84.23 270 top
LED1  61.4,3.9 90 top
LED2  67,3.9 90 top
LED3  69.8,3.9 90 top
LED4  64.2,3.9 90 top
LED5  74.8,3.9 90 top
LED6  77.6,3.9 90 top
LED7  80.5,3.9 90 top
LED8  83.4,3.9 90 top
LNA  81.7,84.4 270 top
PA  58.9,80.8 0 top
R1  83.16,81.8 0 top
R2  90.5,64.1 180 top
R3  92.6,55.1 270 top
R4  61.4,7 90 top
R5  55.6,59.8 90 top
R6  82.55,79.38 90 top
R7  61.2,75.15 180 top
R8  64.2,7 90 top
R9  74.8,7 90 top
R10  77.6,7 90 top
R11  80.5,7 90 top
R12  83.4,7 90 top
SH1  85.2,80.7 0 top
SH2  58.9,80.8 0 top
TP1  89.75,54.75 180 top
TP2  92.6,69.7 0 top
TP3  91.3,49.85 180 top
TP4  95,68 180 top
TP5  94.3,49.85 0 top
TP8  61.31,54.24 180 top
TP9  43.5,86.7 0 top
TP10  87.73,69.23 0 top
TP11  63.84,57.92 180 top
TP12  48.94,56.75 180 top
TP13  53.29,54.48 180 top
TP14  56.7,56.5 270 top
TP15  80.28,45.36 180 top
TP16  47.39,62.94 180 top
TP17  47.39,59.77 180 top
TP18  63.32,61.44 0 top
TRSWITCH  72,83.7 180 top
U$1  92,59.6 0 top
U$7  84.8,79 180 top
U$8  59.4,60.05 90 top
U$9  46.2,84.31 90 top
U$35  [ORESAT-CARD-RF-V0.3]  0,0 0 top
U$39  70.35,78.65 0 top
U$42  51.7,65.35 90 top
Y1  66.77,59.82 270 top

### Tracks (layer width: path | path; a pad name or v marks a point on that pad's centre or on a via)
3.3V  (via drill 0.25)
  Top 0.2: KW0X.1 KW0X.56 KW0X.55 arc90 72.17,55.6 71.05,55.6 C28.2 | C26.1 81.53,57.05 KW0X.19 79.35,57.05 79.35,58.61 76.34,58.61 76.34,61.55 | 76.34,61.55 KW0X.35 76.34,63 76.9,63 | KW0X.43 76.34,61.55 | C27.1 83.26,56.95
  Top 0.5: 78.43,63.68 C30.2 | U$1.8 89.15,62.23 v89.15,62.25 | 76.9,63 C31.2 | 83.26,56.95 v84.79,56.95
  Top 1: C28.2 C29.2 v68,55.35 | C31.2 78.43,63.68 | R3.2 v93.85,54.3 | R8.2 v64.2,11.03 45.81,11.03 | C26.1 C27.1 | JP2.2 40.83,11.03 45.81,11.03 | J1.1 45.81,2.77 45.81,11.03
  Route15 1: v64.2,11.03 64.2,47.3
  other vias: 61.45,62.15
  pour Route15 (isolate 0.2, no thermals): 60.2,64.1 95.3,64.1 95.3,47.2 60.2,47.2
  pour Top (no thermals): 90.4,62.2 90.4,66.45 89.1,66.45 89.1,62.2
  pour Top (no thermals): 60.45,62.45 60.45,60.5 61.2,60.5 61.2,61.65 61.75,61.65 61.75,62.45
!CS  (via drill 0.25)
  Top 0.2: KW0X.27 87.3,61.05 v87.3,61.72 | v88.72,61.25 88.74,61.23 88.74,57.03 U$1.1 90.06,54.75 TP1.TP
  Bottom 0.2: v87.3,61.72 88.72,61.72 v88.72,61.25
!HOLD  (via drill 0.25)
  Top 0.2: U$1.7 91.33,64.1 R2.1 92.75,65.55 v92.75,65.65
  Bottom 0.2: TP10.TP 87.73,67.7 92.75,67.7 v92.75,65.65
!RESET  (via drill 0.25)
  Top 0.2: KW0X.33 77.34,61.44 76.95,61.44 v76.95,60.9 | TP8.TP 56.41,54.24 v49.21,47.09 | v49.2,8.33 54.61,8.33 J1.10
  Bottom 0.2: v76.95,60.9 71.34,60.9 71.35,55.01 71.35,54.24 TP8.TP | v49.21,47.09 49.21,10.37 v49.2,8.33
DIO0  (via drill 0.25)
  Top 0.2: KW0X.49 70,58.55 v69.65,58.9
  Top 0.3: KW0X.48 KW0X.49
  Bottom 0.2: v69.65,58.9 68.55,60 50.25,60 47.39,62.86 TP16.TP
DIO1  (via drill 0.25)
  Top 0.2: KW0X.50 69.05,58.05 v68.95,58.15
  Bottom 0.2: v68.95,58.15 67.75,59.35 47.81,59.35 TP17.TP
DIO5/CLKOUT
  Top 0.2: KW0X.54 72.23,56.07 73.06,56.07 74.08,55.05 KW0X.15 79.97,45.67 TP15.TP
GND  (34 unrouted)
  pour Bottom (isolate 0.2, rank 6): 0,0 0,100 89.3,100 99,100 99,10.4 99,0
  pour Top (isolate 0.2, rank 6): 0,0 0,100 89.3,100 99,100 99,10.4 99,0
  pour Route2 (isolate 0.2): 0,0 0,100 89.3,100 99,100 99,10.4 99,0
  pour Route15 (isolate 0.2, rank 6): 0,0 0,100 89.3,100 99,100 99,10.4 99,0
LNA_EN  (via drill 0.25)
  Top 0.2: U$7.3 86.17,77.54 v86.17,76.14 | KW0X.17 80.65,56.05 80.65,53.88 80.44,53.88 80.44,49.16 83.93,49.16 v83.93,54.24 | C48.2 84.4,71.25 v86.17,71.25
  Route15 0.2: v86.17,76.14 v86.17,71.25 86.17,54.24 v83.93,54.24
LNA_IN
  Top 0.2: 74.68,83.68 C23.1 | TRSWITCH.2 73.37,83.69
  Top 0.343: 73.37,83.69 74.7,83.69 C23.1
LNA_OUT
  Top 0.343: C12.2 L6.2 C25.1
MISO
  Top 0.2: KW0X.29 79.73,62.18 80.52,62.97 87.96,62.97 87.96,52.4 91.33,52.4 | 91.33,52.4 U$1.2 | TP3.TP 91.33,49.85 91.33,52.4
MOSI
  Top 0.2: KW0X.31 78.34,62.85 79.43,62.85 83.35,66.77 93.88,66.77 | 93.88,66.77 93.88,62.23 U$1.5 | TP4.TP 95,66.77 93.88,66.77
N$1
  Top 0.2: U$7.4 C37.1
N$2
  Top 0.2: U$39.4 72.47,81.12 TRSWITCH.12
N$3  (via drill 0.25)
  Top 0.2: KW0X.51 69.81,57.55 v68.35,57.55
  Bottom 0.2: v68.35,57.55 64.21,57.55 TP11.TP
N$4
  Top 0.2: U$9.4 43.5,86.6 TP9.TP
N$5
  Top 0.2: KW0X.52 68.91,57.05 68.55,56.7 67.9,56.7 67.1,55.9 58.5,55.9 57.4,54.8 55.9,54.8 53.95,56.75 TP12.TP
N$6
  Top 0.2: KW0X.46 68.27,60.05 68,59.79 66.59,59.79 66.16,60.21 66.16,60.62 Y1.1 | 66.13,60.64 64.07,60.64 TP18.TP
  Top 0.3: Y1.1 66.13,60.64 C34.2
N$7
  Top 0.343: C25.2 83.99,85 L8.1 83.94,85.05 LNA.6
N$8
  Top 0.2: KW0X.47 68.53,59.55 67.96,58.99 Y1.3
  Top 0.3: Y1.3 67.41,58.99 C35.2
N$9  (via drill 0.25)
  Top 0.2: KW0X.53 70.36,56.55 v70.2,56.4
  Bottom 0.2: v70.2,56.4 59.05,56.4 57.15,54.5 53.31,54.5 TP13.TP
N$10
  Top 0.343: C5.2 L3.1 C7.1
N$11
  Top 0.2: U$1.3 92.58,55.9 R3.1 95.6,55.9 95.6,51.15 TP5.TP
N$12
  Top 0.2: TP14.TP 55.6,56.5 R5.1 58.22,59 U$8.3
N$13
  Top 0.2: U$8.4 60.6,58.77 C40.1
N$14
  Top 1: R4.1 LED1.A
N$15
  Top 0.2: R9.1 LED5.A
N$16
  Top 0.343: C7.2 L3.2 | L3.2 L5.1 | C9.2 L3.2
N$17
  Top 0.343: C11.2 L5.2 C14.2
N$18
  Top 0.343: C6.2 L4.1 C8.1
N$19
  Top 0.2: C8.2 | L4.2 | C10.2
  Top 0.343: C8.2 C10.2 | L4.2 L6.1 C10.2
N$20
  Top 0.2: R10.1 LED6.A
N$21
  Top 0.2: R11.1 LED7.A
N$22
  Top 1: R8.1 LED4.A
N$23
  Top 0.2: R12.1 LED8.A
N$25
  Top 0.343: C23.2 LNA.3
N$27
  Top 0.2: 82.5,81.8 R1.1 82.9,82.34 82.9,83.75 LNA.4
N$30
  Top 0.2: 72,88.4 CF2.CENTER | TRSWITCH.5 72.02,85.1
  Top 0.343: 72.02,85.1 72.02,88.38 CF2.CENTER
N$31
  Top 0.2: KW0X.44 70.93,61.05 C32.2
N$34
  Top 0.2: KW0X.45 69.33,60.55 C33.2
N$43
  Top 0.2: 54.5,74.9 54.7,74.9
  Top 0.343: PA.2 54.14,80.74 arc90 53.1,79.7 53.1,76.3 arc90 54.5,74.9 | 54.7,74.9 arc-90 55.8,73.8 55.8,69.7 arc90 C14.1
PA_BOOST
  Top 0.343: KW0X.41 73.34,63.56 71.1,65.8 L1.2 C5.1 C2.1
PA_EN  (via drill 0.25)
  Top 0.2: v81.07,51.57 81.07,56.55 KW0X.18 | U$9.5 v43.71,84.29
  Bottom 0.2: v81.07,51.57 48.18,51.57 43.7,56.05 43.7,84.28
  Bottom 0.406: 43.7,84.28 v43.71,84.29
PA_IN
  Top 0.2: TRSWITCH.8 70.62,83.68 70.62,83.7
  Top 0.343: PA.8 63.74,80.74 arc90 64.6,81.6 64.6,82.6 arc-90 65.7,83.7 70.62,83.7
PTB2  (via drill 0.25)
  Top 0.2: KW0X.21 84.07,58.05 v84.07,57.85 | v44.69,64.91 v42.13,64.91 v42.13,64.92
  Bottom 0.2: CF1.P$1 v42.13,64.92 | v84.07,57.85 84.07,61.69 65.69,61.69 62.47,64.91 v44.69,64.91
PTB17  (via drill 0.25)
  Top 0.2: KW0X.22 85.58,58.55 85.58,43.84 29.12,43.84 v29.12,43.61 | CF1.P$2 42.13,88.89 29.11,75.87 v29.11,47.12
  Bottom 0.2: v29.12,43.61 29.11,43.71 v29.11,47.12
PTC1  (via drill 0.25)
  Top 0.2: KW0X.24 86.51,59.55 86.52,42.52 v81.9,42.52 | v74.81,9.38 R9.2
  Bottom 0.2: CF1.P$3 40.82,11.58 38.3,8.95 JP2.3 38.29,0.67 72.93,0.67 72.93,9.38 v74.81,9.38 81.9,9.38 v81.9,42.52
PTC2  (via drill 0.25)
  Top 0.2: KW0X.25 86.95,60.05 86.95,41.85 85.94,41.85 | 85.94,41.85 34.25,41.85 | 34.25,41.85 27.51,41.85 v27.51,43.21 | v83.36,11.51 77.6,11.51 R10.2 | CF1.P$4 40.86,89.38 27.52,76.04 v27.51,47.13 | JP2.4 35.75,35.1 34.25,36.6 34.25,41.85 | v85.94,41.79 85.94,41.85
  Bottom 0.2: v85.94,41.79 85.94,11.51 v83.36,11.51 | v27.51,43.21 v27.52,43.21 v27.51,47.13
PTC3  (via drill 0.25)
  Top 0.2: KW0X.26 87.5,60.56 87.51,41.04 | 87.51,41.04 v35.13,41.04 | R11.2 80.51,10.88 87.5,10.88 87.51,10.89 87.51,41.04 | JP2.5 v33.21,41.04 | v33.14,47.08 33.14,48.74 v39.6,55.2
  Bottom 0.2: CF1.P$5 v39.59,55.21 v39.6,55.2 | v33.14,47.08 33.14,41.29 v33.21,41.04 v35.13,41.04
PTC4  (via drill 0.25)
  Top 0.2: KW0X.23 86.04,59.05 86.03,43.15 v82.73,43.15 v30.4,43.15 | v83.38,9.36 83.38,7.8 R12.2 | CF1.P$6 39.59,89.85 25.81,76.07 25.81,47.15 25.83,47.17 25.83,47.18 25.82,47.17 v25.82,47.1 | v25.83,43.2 25.83,11.31 30.7,6.44 30.7,3.63 JP2.6
  Bottom 0.2: v82.73,43.15 82.73,9.36 v83.38,9.36 | v25.82,47.1 25.82,43.22 v25.83,43.2 26.88,42.15 30,42.15 30.4,42.55 v30.4,43.15
PTC5  (via drill 0.25)
  Top 0.2: KW0X.59 79.05,59.85 v79.05,59.3 | v39.95,51.35 v41.65,51.35
  Bottom 0.2: v79.05,59.3 79.05,53.85 82.11,53.85 82.11,49.39 46.6,49.4 44.65,51.35 v41.65,51.35 | 38.32,51.39 38.32,13.79 JP2.7 | 38.32,51.39 CF1.P$7 | 38.32,51.39 39.91,51.39 v39.95,51.35
PTC6  (via drill 0.25)
  Top 0.2: KW0X.60 78.84,60.94 78.35,60.45 78.35,59.75 v78.05,59.2 | CF1.P$8 38.32,90.15 24.25,76.08 v24.25,63.61 v24.25,47.14 | JP2.8 24.23,4.96 v24.23,43.2 | v44.7,63.6 v38.32,63.6 v29.78,63.6
  Bottom 0.2: v78.05,59.2 78.05,58.54 72.14,58.54 72.14,52.35 48.51,52.35 44.7,56.16 v44.7,63.6 | v24.23,43.2 24.25,43.22 v24.25,47.14 | v29.78,63.6 v29.77,63.61 v24.25,63.61
PTC7  (via drill 0.25)
  Top 0.2: v37.67,48.76 37.67,48.74 v41.59,48.74 | KW0X.57 77.81,60.05 77.81,60.04 77.8,60.04 77.8,59.94 v77.08,59.22
  Bottom 0.2: JP2.9 37.05,17.6 37.05,48.76 | 37.05,48.76 CF1.P$9 | 37.05,48.76 v37.67,48.76 | v41.59,48.74 82.52,48.74 82.52,60.04 77.58,60.04 77.58,59.72 v77.08,59.22
PTD0  (via drill 0.25)
  Top 0.2: KW0X.58 77.84,60.94 v76.95,60.05 | CF1.P$10 37.05,90.54 22.66,76.15 v22.66,56.59 | v45.5,56.58 v29.77,56.58 v29.76,56.57
  Bottom 0.2: v76.95,60.05 71.75,60.04 71.75,52.81 49.27,52.81 v45.5,56.58 | v29.76,56.57 v22.66,56.59
PTE16  (via drill 0.25)
  Top 0.2: KW0X.5 74.84,52.35 70.75,48.26 70.7,48.26 v70.7,48.12 | v36.39,33.32 55.9,33.32 v63.03,40.45
  Bottom 0.2: CF1.P$11 35.78,57.92 35.8,57.9 35.8,33.91 v36.39,33.32 | v63.03,40.45 v70.7,48.12
PTE17
  Top 0.2: KW0X.6 75.34,51.44 70.2,46.3 21.01,46.3 21.01,76.23 35.78,91 CF1.P$12
PTE18  (via drill 0.25)
  Top 0.2: KW0X.7 75.84,50.82 v73.13,48.11 | v65.44,40.36 56.69,31.61 v36.43,31.61
  Bottom 0.2: CF1.P$13 34.51,58.31 34.4,58.2 34.39,58.2 31.85,55.66 31.85,36.19 v36.43,31.61 | v73.13,48.11 73.18,48.1 v65.44,40.36
PTE19
  Top 0.2: KW0X.8 76.34,50 71.94,45.6 19.46,45.6 19.46,76.19 34.51,91.24 CF1.P$14
RF_GND
  Top 0.2: KW0X.40 73.84,65.06 73.25,65.65 | KW0X.38 74.84,64.59 75.2,64.95 75.5,64.95 76.05,64.4 76.05,63.9 75.9,63.75 75.9,62.18 KW0X.36
  Top 0.406: C33.1 69.65,63.45 C32.1
  pour Top: 46,90.05 96.35,90.05 96.45,67.2 83.4,67.2 79.3,63.1 64.4,63 61.9,65.85 49.05,65.85 46,68.9
RFIO
  Top 0.343: KW0X.39 74.34,64.74 76.7,67.1 79.4,67.1 82.6,70.3 82.6,73 83.1,73.5 L2.2 87.5,74.1 89.4,76 C6.1 C4.1
RXTX  (via drill 0.25)
  Top 0.2: v70.35,70.3 U$39.2 | KW0X.37 75.34,64.04 v75.45,64.15
  Bottom 0.2: v75.45,64.15 v70.35,70.3
SCLK  (via drill 0.25)
  Top 0.2: KW0X.28 84.57,61.55 v84.57,62.11 | v92.58,63.41 U$1.6
  Bottom 0.2: v84.57,62.11 84.57,63.41 v92.58,63.41 | 92.6,63.41 v92.58,63.41 | TP2.TP 97,69.7 97,63.4 v92.58,63.4 v92.58,63.41
SWD_CLK  (via drill 0.25)
  Top 0.2: KW0X.10 77.34,48.31 v76.78,47.75
  Bottom 0.2: v76.78,47.75 50.8,21.77 J1.4
SWD_DIO  (via drill 0.25)
  Top 0.2: KW0X.11 77.84,47.76 v77.85,47.75 | v51.7,7.35 49.53,7.35 J1.2
  Bottom 0.2: v77.85,47.75 51.7,21.6 v51.7,7.35
UART0_RX  (via drill 0.25)
  Top 0.2: KW0X.14 79.34,47.11 76.52,44.29 v18.67,44.29 | CF1.P$18 31.97,91.7 16.8,76.53 v16.8,44.29 16.8,8.43 v16.73,8.36
  Bottom 0.2: CF1.P$17 CF1.P$18 | v16.73,8.36 20.51,8.36 JP2.10 | v18.67,44.29 v16.8,44.29
UART0_TX
  Top 0.2: KW0X.13 78.84,47.25 76.55,44.96 18.07,44.96 | CF1.P$16 33.24,91.5 18.07,76.33 18.07,45.08 18.07,44.96 | 18.07,44.96 18.07,3.7 JP2.11
  Bottom 0.2: CF1.P$15 CF1.P$16
V+  (via drill 0.25)
  Top 0.2: v70.61,81.75 v70.6,81.75
  Top 0.4: v70.61,81.75 71.56,81.75 TRSWITCH.10
  Top 0.5: U$9.6 C13.2 | C38.1 U$7.1 v83.95,75.8
  Top 1: C13.2 v44.85,80.45 | R4.2 v61.4,9.5 | v70.61,81.75 69.4,80.54 U$39.5
  Route15 1: 51.3,9.52 43.37,9.52 JP2.1 | 51.3,9.52 51.3,60.54 | 51.3,9.52 61.4,9.52 v61.4,9.5 | v70.6,81.75 68.69,79.85 | 68.69,79.85 78,79.85 82.05,75.8 v83.95,75.8 | 68.69,79.85 68.69,71.9 57.95,71.9 57.95,70.85 58.05,70.85
  other vias: 55.25,61.9
  pour Route15 (isolate 0.2, no thermals): 20,98.5 20,60 58.6,60 58.55,71.3 49.6,71.3 49.65,75.05 49.7,88.45 22.4,88.4 22.4,98.5
  pour Top (no thermals): 58.25,60.45 54.9,60.45 54.9,62.2 56,62.2 56,61.3 58.25,61.3
V_LNA_FILTERED  (via drill 0.25)
  Top 0.2: 66.95,4.7 LED2.A
  Top 1: R6.1 v82.55,77.2 | v66.95,7.95 66.95,4.7 | C47.2 94.65,77.25 v94.7,77.2
  Route15 1: v82.55,77.2 v94.7,77.2 96.8,77.2 96.8,37.8 v66.95,7.95
V_PA_FILTERED  (via drill 0.25)
  Top 0.2: C45.2 63.45,71.4 62,71.4
  Top 1: R7.1 62,71.4 v62,70.44 | v59.37,12.32 69.8,12.32 LED3.A
  Route15 1: v62,70.44 62,67.39 59.35,64.74 59.35,12.34 v59.37,12.32
VBIAS
  Top 0.2: 83.96,80.77 U$7.5 R6.2 C44.1 77.9,77.3 C43.+ | 83.96,80.77 R1.2 L8.2 | C36.1 C24.1 85.41,80.77 83.96,80.77
VPA  (via drill 0.25)
  Top 0.2: 55.37,76.97 v55.35,76.95
  Top 1: PA.4 55.37,76.97
  Route15 0.2: v55.35,76.95 55.9,77.5 55.9,83.15 55.3,83.75 v55.3,84
  pour Top (isolate 0.2, no thermals): 61.6,83.7 61.6,88 60.8,88 60.8,86.5 57.3,86.5 57.3,87.9 56.4,87.9 56.4,84.4 47.3,84.4 47.3,83.2 53.5,83.2 54,83.7
  pour Top (no thermals): 61.05,74.6 56.1,74.6 56.1,77.65 57.7,77.65 57.7,76.05 61.05,76.05
VR_PA  (via drill 0.25)
  Top 0.2: C1.2 L2.1 81.5,73.4 81.9,73 81.9,70.5 79.3,67.9 76.3,67.9 v75,66.6 | 72.82,62.2 KW0X.42 72.84,63.13 v72.28,63.69 71.77,64.2 L1.1 C3.1
  Route15 0.2: v75,66.6 72.3,63.9 v72.28,63.69

### Text on the board
tPlace: GND | TX | RX | C7 | C6 | C5 | C4 | C3 | C2 | C1 | 3.3 | V+ | V+ | 3.3 | LNA | PA | C1 | C2 | C3 | C4
TODO: Cut power plane to here